# EAGLE design Primate (EAGLE 9.6.2)

## Sheet 1 of 2
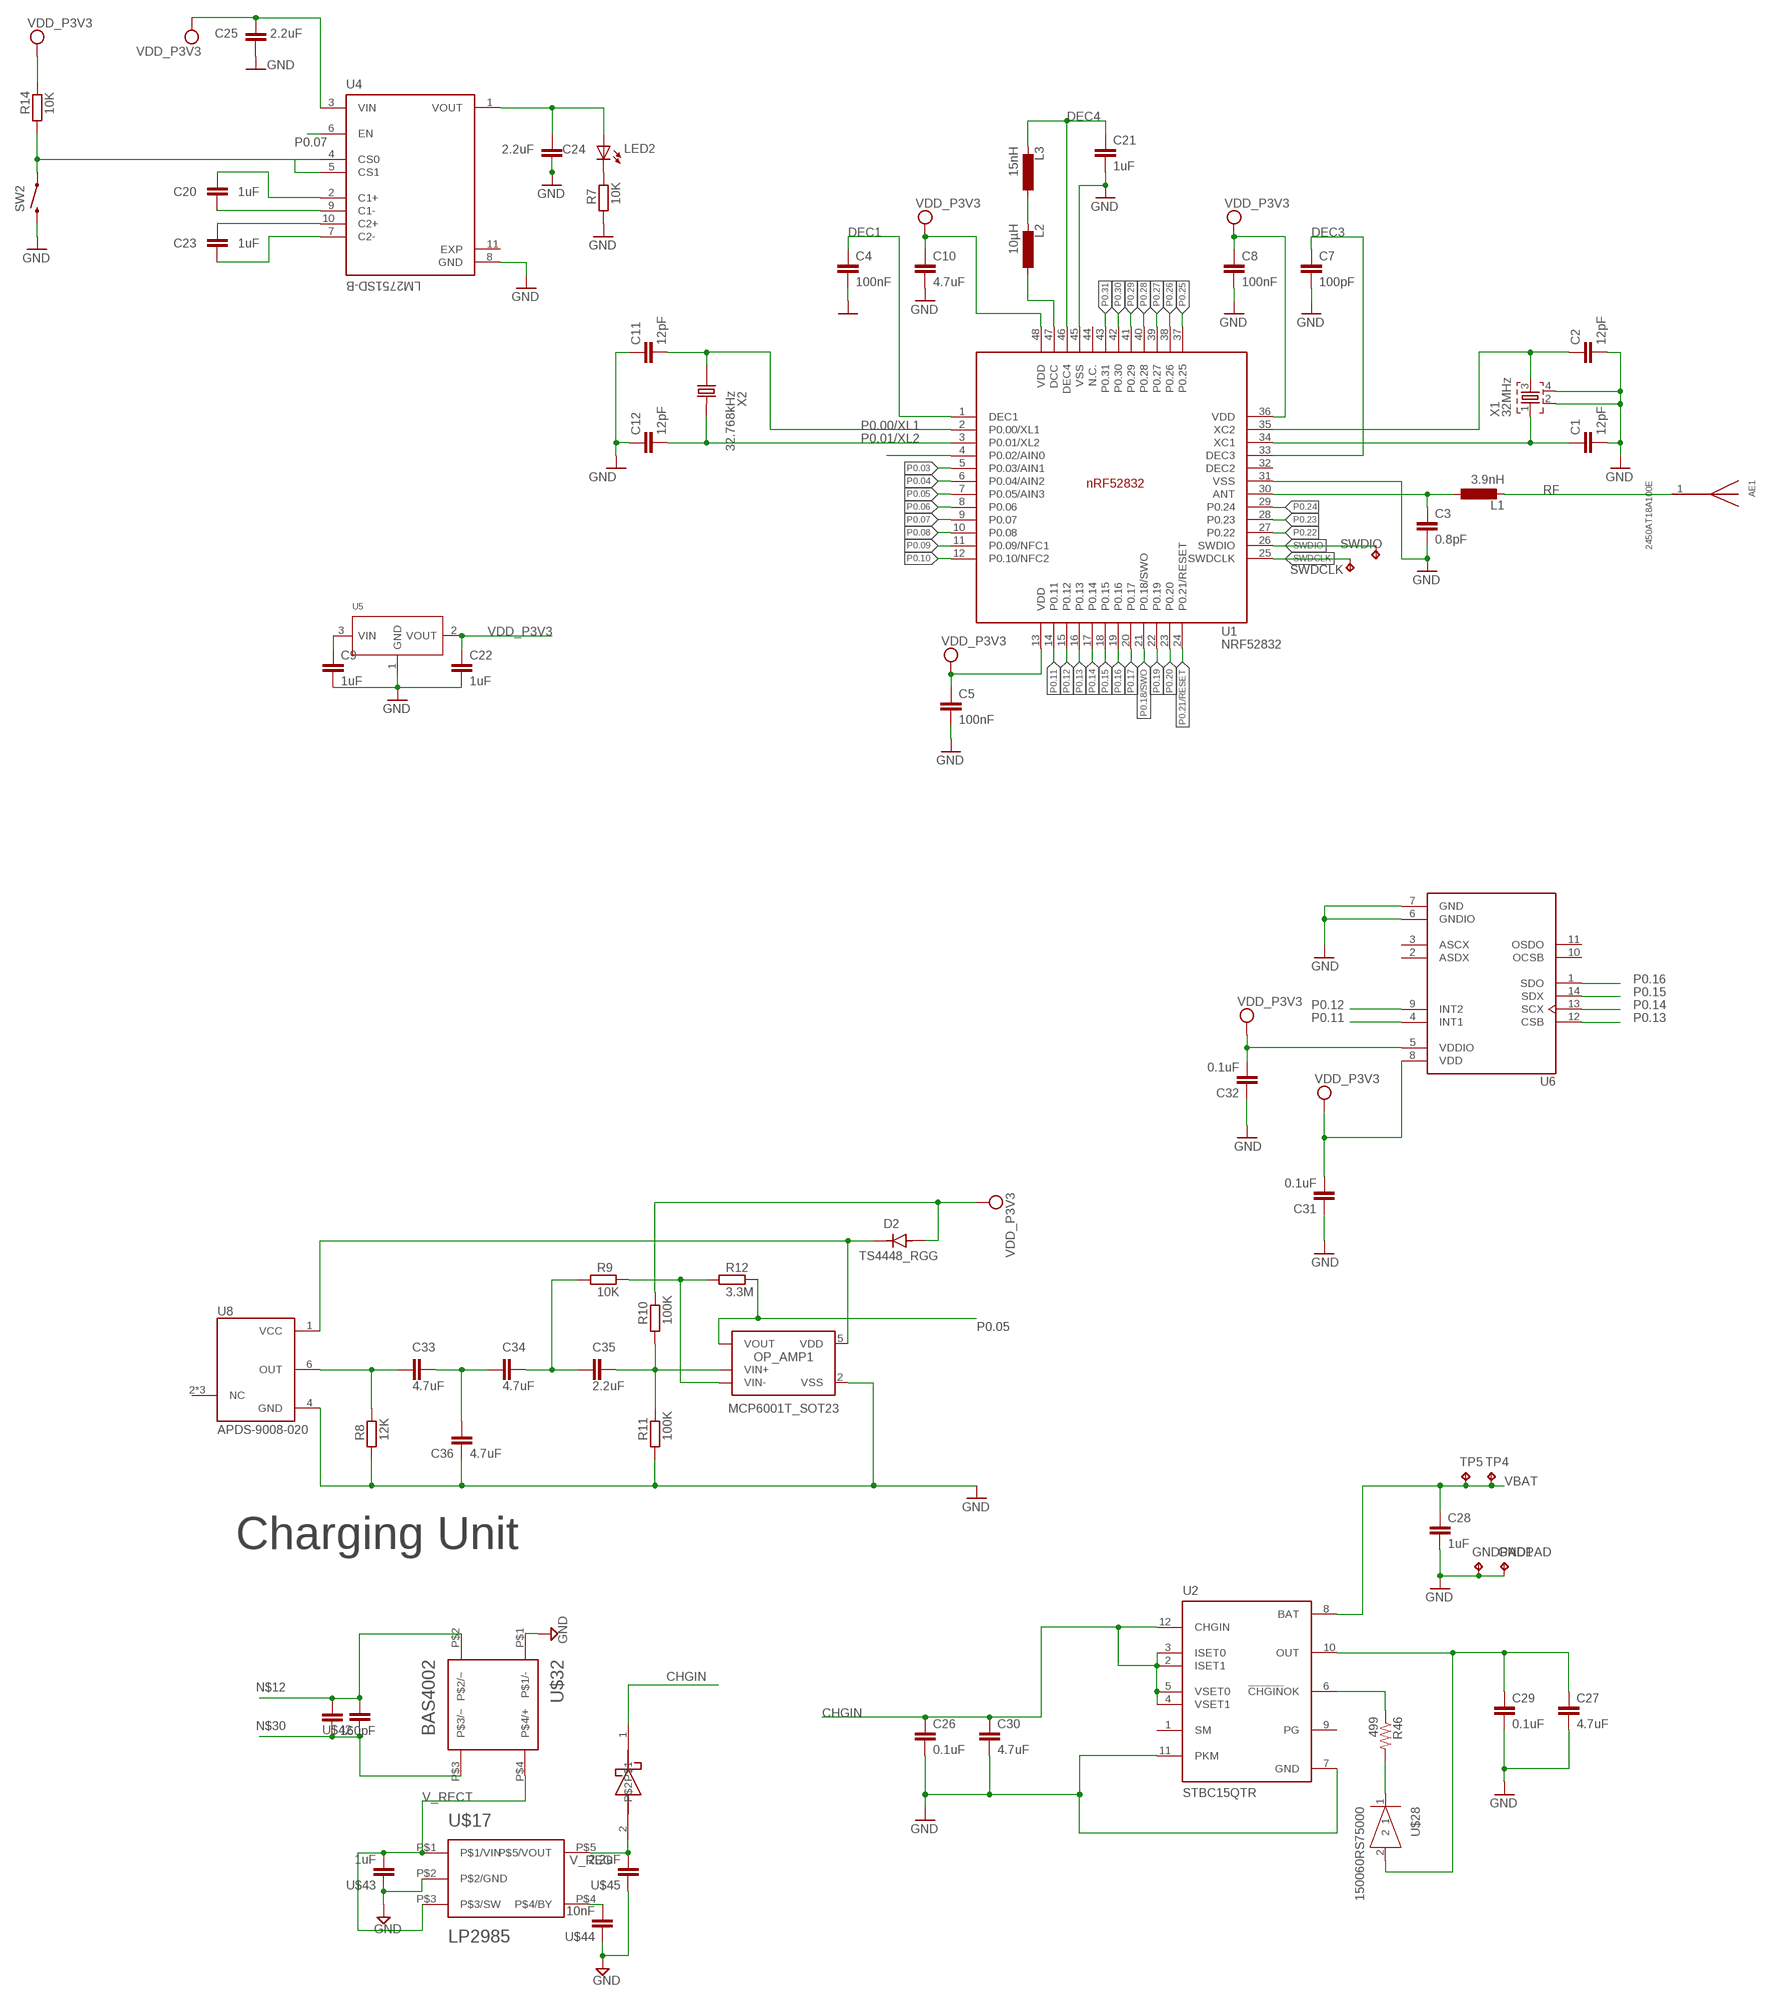
[diagram p0: schematic, sheet 1]

### Parts
AE1  2450AT18A100E  [ANTC3216X140N]
C1  12pF  C-EUC0201  [C0201]
C2  12pF  C-EUC0201  [C0201]
C3  0.8pF  C-EUC0201  [C0201]
C4  100nF  C-EUC0201  [C0201]
C5  100nF  C-EUC0201  [C0201]
C7  100pF  C-EUC0201  [C0201]
C8  100nF  C-EUC0201  [C0201]
C9  1uF  C-EUC0201  [C0201]
C10  4.7uF  C-EUC0402  [C0402]
C11  12pF  C-EUC0201  [C0201]
C12  12pF  C-EUC0201  [C0201]
C20  1uF  C-EUC0201  [C0201]
C21  1uF  C-EUC0201  [C0201]
C22  1uF  C-EUC0201  [C0201]
C23  1uF  C-EUC0201  [C0201]
C24  2.2uF  C-EUC0402  [C0402]
C25  2.2uF  C-EUC0402  [C0402]
C26  0.1uF  C-EUC0201  [C0201]
C27  4.7uF  C-EUC0402  [C0402]
C28  1uF  C-EUC0201  [C0201]
C29  0.1uF  C-EUC0201  [C0201]
C30  4.7uF  C-EUC0402  [C0402]
C31  0.1uF  C-EUC0201  [C0201]
C32  0.1uF  C-EUC0201  [C0201]
C33  4.7uF  C-EUC0402  [C0402]
C34  4.7uF  C-EUC0402  [C0402]
C35  2.2uF  C-EUC0402  [C0402]
C36  4.7uF  C-EUC0402  [C0402]
D2  TS4448_RGG  [DIO_TS4448_RGG]
GNDPAD  TPTP20SQ  [TP20SQ]
GNDPAD1  TPTP20SQ  [TP20SQ]
L1  3.9nH  L-EUL0201  [L0201]
L2  10µH  L-EUL0201  [L0201]
L3  15nH  L-EUL0201  [L0201]
LED2  LEDCHIPLED_0805  [CHIPLED_0805]
OP_AMP1  MCP6001T_SOT23  [SOT95P280X145-5N]
R7  10K  RR0603  [R0603]
R8  12K  RR0603  [R0603]
R9  10K  RR0603  [R0603]
R10  100K  RR0603  [R0603]
R11  100K  RR0603  [R0603]
R12  3.3M  RR0603  [R0603]
R14  10K  RR0603  [R0603]
R46  499  R-US_R0201  [R0201]
SW2  RS032G05A3SM-SPST-MOMENTARY-SWSMD-1101NE  [TACTILE-SWITCH-1101NE]
SWDCLK  TPB1,27  [B1,27]
SWDIO  TPB1,27  [B1,27]
TP4  TPTP20SQ  [TP20SQ]
TP5  TPTP20SQ  [TP20SQ]
U1  NRF52832  [QFN40P600X600X90-48_N]
U2  STBC15QTR  [QFN40P200X170X55-12N]
U4  LM2751SD-B  [SON50P300X300X80-11N]
U5  PMIC-LDO-XC6206P302MR(SOT23)  [SOT-23]
U6  BMI160  [PQFN50P250X300X88-14N]
U8  APDS-9008-020  [XDCR_APDS-9008-020]
U$17  LP2985  [SOT-23]
U$28  150060RS75000  [150060RS75000]
U$32  BAS4002  [SOT143]
U$41  160pF  C-EUC0201  [C0201]
U$42  5pF  C-EUC0201  [C0201]
U$43  1uF  C-EUC0201  [C0201]
U$44  10nF  C-EUC0201  [C0201]
U$45  2.2uF  C-EUC0201  [C0201]
U$46  CDBQC0130L-HF  [0402DIODE]
X1  32MHz  XTAL_32MHZ  [BT-XTAL_2016_N]
X2  32.768kHz  ECS-.327-7-12-TR  [XTAL_ECS-.327-7-12-TR]

### Nets
ANT: C3.1 L1.1 U1.30(ANT)
CHGIN: C26.1 C30.1 U2.2(ISET1) U2.3(ISET0) U2.4(VSET1) U2.5(VSET0) U2.12(CHGIN) U$46.1
DEC1: C4.1 U1.1(DEC1)
DEC3: C7.1 U1.33(DEC3)
DEC4: C21.1 L3.2 U1.46(DEC4)
GND: C1.2 C2.2 C3.2 C4.2 C5.2 C7.2 C8.2 C9.2 C10.2 C11.1 C12.1 C21.2 C22.2 C24.2 C25.2 C26.2 C27.2 C28.2 C29.2 C30.2 C31.1 C32.1 C36.2 GNDPAD1.TP GNDPAD.TP OP_AMP1.2(VSS) R7.1 R8.1 R11.1 SW2.2 U1.31(VSS) U1.45(VSS) U2.7(GND) U2.11(PKM) U4.8(GND) U5.1(GND) U6.6(GNDIO) U6.7(GND) U8.4(GND) U$17.P$2(P$2/GND) U$32.P$1(P$1/-) U$43.1 U$44.1 U$45.1 X1.2 X1.4
N$2: L2.2 L3.1
N$3: C2.1 U1.35(XC2) X1.3
N$4: L2.1 U1.47(DCC)
N$12: U$32.P$2(P$2/~) U$41.1 U$42.2
N$13: R46.2 U$28.1
N$25: C33.2 R8.2 U8.6(OUT)
N$26: C27.1 C29.1 U2.10(OUT) U$28.2
N$28: R46.1 U2.6(!CHGIN!OK)
N$30: U$32.P$3(P$3/~) U$41.2 U$42.1
N$41: U$17.P$4(P$4/BY) U$44.2
N$48: C20.1 U4.2(C1+)
N$49: C20.2 U4.9(C1-)
N$50: C23.1 U4.10(C2+)
N$51: C24.1 LED2.A U4.1(VOUT)
N$52: C23.2 U4.7(C2-)
N$53: C33.1 C34.2 C36.1
N$54: LED2.C R7.2
N$55: C34.1 C35.2 R9.1
N$56: D2.C(K) OP_AMP1.5(VDD) U8.1(VCC)
N$58: C35.1 OP_AMP1.3(VIN+) R10.1 R11.2
N$59: OP_AMP1.4(VIN-) R9.2 R12.1
N$66: U4.4(CS0) U4.5(CS1)
N$68: R14.1 SW2.1
OUT: U1.4(P0.02/AIN0)
P0.00/XL1: C11.2 U1.2(P0.00/XL1) X2.1
P0.01/XL2: C12.2 U1.3(P0.01/XL2) X2.2
P0.03: U1.5(P0.03/AIN1)
P0.04: U1.6(P0.04/AIN2)
P0.05: OP_AMP1.1(VOUT) R12.2 U1.7(P0.05/AIN3)
P0.06: U1.8(P0.06)
P0.07: U1.9(P0.07) U4.6(EN)
P0.08: U1.10(P0.08)
P0.09: U1.11(P0.09/NFC1)
P0.10: U1.12(P0.10/NFC2)
P0.11: U1.14(P0.11) U6.4(INT1)
P0.12: U1.15(P0.12) U6.9(INT2)
P0.13: U1.16(P0.13) U6.12(CSB)
P0.14: U1.17(P0.14) U6.13(SCX)
P0.15: U1.18(P0.15) U6.14(SDX)
P0.16: U1.19(P0.16) U6.1(SDO)
P0.17: U1.20(P0.17)
P0.18/SWO: U1.21(P0.18/SWO)
P0.19: U1.22(P0.19)
P0.20: U1.23(P0.20)
P0.21/RESET: U1.24(P0.21/RESET)
P0.22: U1.27(P0.22)
P0.23: U1.28(P0.23)
P0.24: U1.29(P0.24)
P0.25: U1.37(P0.25)
P0.26: U1.38(P0.26)
P0.27: U1.39(P0.27)
P0.28: U1.40(P0.28)
P0.29: U1.41(P0.29)
P0.30: U1.42(P0.30)
P0.31: U1.43(P0.31)
RF: AE1.1 L1.2
SWDCLK: SWDCLK.TP U1.25(SWDCLK)
SWDIO: SWDIO.TP U1.26(SWDIO)
V_RECT: U$17.P$1(P$1/VIN) U$17.P$3(P$3/SW) U$32.P$4(P$4/+) U$43.2
V_REG: U$17.P$5(P$5/VOUT) U$45.2 U$46.2
VBAT: C28.1 TP4.TP TP5.TP U2.8(BAT)
VBAT1: C9.1 U5.3(VIN)
VDD_P3V3: C5.1 C8.1 C10.1 C22.1 C25.1 C31.2 C32.2 D2.A R10.2 R14.2 U1.13(VDD) U1.36(VDD) U1.48(VDD) U4.3(VIN) U5.2(VOUT) U6.5(VDDIO) U6.8(VDD)
X1: C1.1 U1.34(XC1) X1.1
Unconnected: U1.32(DEC2) U1.44(N.C.) U2.1(SM) U2.9(PG) U6.2(ASDX) U6.3(ASCX) U6.10(OCSB) U6.11(OSDO) U8.2(NC) U8.3(NC) U8.5(NC)

### Notes on the sheet
- Charging Unit

## Sheet 2 of 2
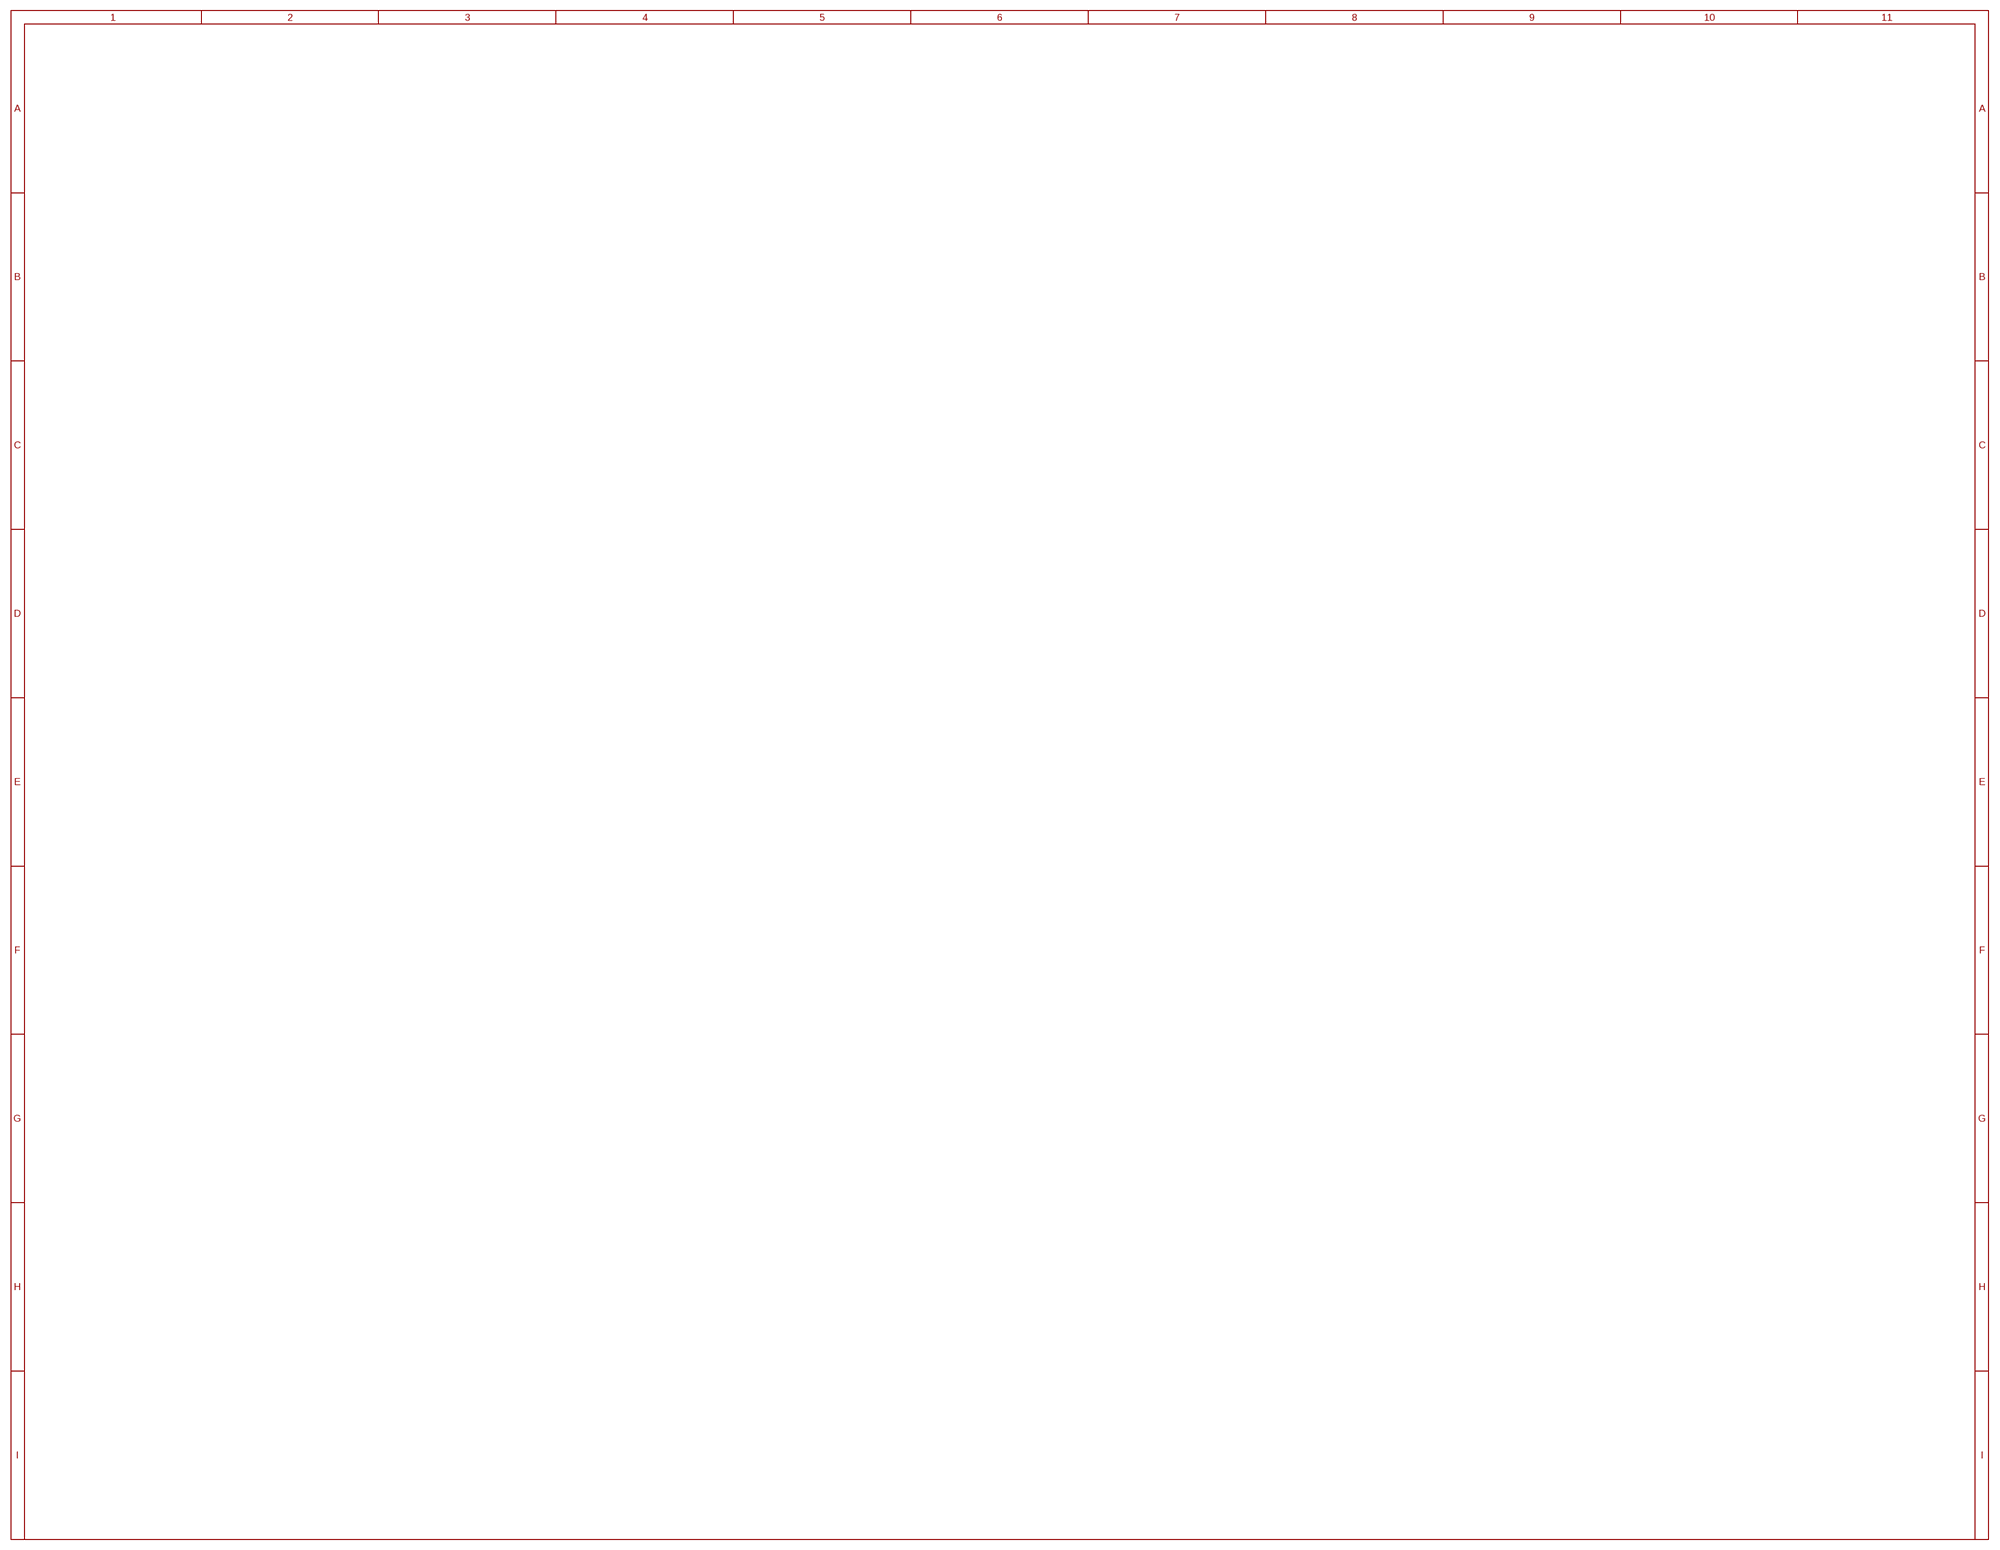
[diagram p1: schematic, sheet 2]

## Power pins joined to a net without a drawn wire
EXP: U4.11(EXP)

## Library data of the parts
AE1 = 2450AT18A100E:2450AT18A100E: ANTENNA, CERAMIC, 2.45GHZ; Bandwidth: 100MHz; Frequency: 2.45GHz; Gain: -0.5dB; Impedance: 50ohm; DESCRIPTION: ANTENNA, CERAMIC, 2.45GHZ; Bandwidth: 100MHz; Frequency: 2.45GHz; Gain: -0.5dB; Impedance: 50ohm; DIGI-KEY_PART_NUMBER: 712-1005-1-ND; DIGI-KEY_PURCHASE_URL: https://www.digikey.com/product-detail/en/johanson-technology-inc/2450AT18A100E/712-1005-1-ND/1560834?utm_source=snapeda&utm_medium=aggregator&utm_campaign=symbol; MF: Johanson Technology; MP: 2450AT18A100E; PACKAGE: FBGA-780 Johanson
C1-C5 C7-C12 C20-C36 U$41-U$45 = rcl:C-EU: CAPACITOR, European symbol; SPICEPREFIX: C
D2 = TS4448_RGG:TS4448_RGG: Check availability; AVAILABILITY: In Stock; DESCRIPTION: 603, 100V, 0.125A, Switching Diode & Array; MF: Taiwan Semiconductor; MP: TS4448 RGG; PACKAGE: 0603 Taiwan Semiconductor; PRICE: None; PURCHASE-URL: https://pricing.snapeda.com/search/part/TS4448 RGG/?ref=eda
GNDPAD GNDPAD1 TP4 TP5 = testpad150:TP: Test pad
L1-L3 = rcl:L-EU: INDUCTOR, European symbol; SPICEPREFIX: L
LED2 = adafruit:LED: LED OSRAM: - CHIPLED LG R971, LG N971, LY N971, LG Q971, LY Q971, LO R971, LY R971 LH N974, LH R974 LS Q976, LO Q976, LY Q976 LO Q996 - Hyper CHIPLED LW Q18S LB Q993, LB Q99A, LB R99A - SideLED LS A670, LO A670, LY A670, LG A670, LP A670 LB A673, LV A673, LT A673, LW A673 LH A674 LY A675 LS A676, LA A676, LO A676, LY A676, LW A676 LS A679, LY A679, LG A679 - Hyper Micro SIDELED® LS Y876, LA Y876, LO Y876, LY Y876 LT Y87S - SmartLED LW L88C, LW L88S LB L89C, LB L89S, LG L890 LS L89K, LO L89K, LY L89K LS L896, LA L896, LO L896, LY L896 - TOPLED LS T670, LO T670, LY T670, LG T670, LP T670 LSG T670, LSP T670, LSY T670, LOP T670, LYG T670 LG T671, LOG T671, LSG T671 LB T673, LV T673, LT T673, LW T673 LH T674 LS T676, LA T676, LO T676, LY T676, LB T676, LH T676, LSB T676, LW T676 LB T67C, LV T67C, LT T67C, LS T67K, LO T67K, LY T67K, LW E67C LS E67B, LA E67B, LO E67B, LY E67B, LB E67C, LV E67C, LT E67C LW T67C LS T679, LY T679, LG T679 LS T770, LO T770, LY T770, LG T770, LP T770 LB T773, LV T773, LT T773, LW T773 LH T774 LS E675, LA E675, LY E675, LS T675 LS T776, LA T776, LO T776, LY T776, LB T776 LHGB T686 LT T68C, LB T68C - Hyper Mini TOPLED® LB M676 - Mini TOPLED Santana® LG M470 LS M47K, LO M47K, LY M47K Source: http://www.osram.convergy.de/
OP_AMP1 = IC_Linear:MCP6001T: Low-Power Operational Amplifier Reference Datasheet; CATEGORY: Amplifier; DESCRIPTION: Low-Power Operational Amplifier; MANUFACTURER: Microchip Technology; MPN: Generic; SERIES: MCP6001; SUB-CATEGORY: OpAmp
R7-R12 R14 = eagle-ltspice:R: RESISTOR, European symbol; SPICEMODEL: NONE; SPICEPREFIX: R
R46 = R_0201_custom:R-US_: RESISTOR, American symbol; SPICEPREFIX: R
SW2 = BeagleBone_Blue_R3:RS032G05A3SM-SPST-MOMENTARY-SW: 6x3.5mm 2-pin Momentary Switch (Push-button) Digikey Link Datasheet; PROD_ID: SWCH-00815
SWDCLK SWDIO = testpad:TP: Test pad
U1 = Nordic_nRF_2:NRF52832: nRF52832 Features Single chip, highly flexible, 2.4 GHz multi-protocol SoC 32-bit ARM Cortex-M4F Processor 1.7v to 3.6v operation 512kB flash + 64kB RAM Supports concurrent Bluetooth Smart/ANT protocol operation On-chip NFC tag for Out-of-Band (OOB) pairing Up to +4dBm output power -96dBm sensitivity, Bluetooth Smart Thread safe and run-time protected Event driven API On air compatible with nRF24L and nRF24AP series 2 data rates (2Mbps/1Mbps) PPI - maximum flexibility for power-efficient applications and code simplification Automated power management system with automatic power management of each peripheral Configurable I/O mapping for analog and digital I/O 3 x Master/Slave SPI 2 x Two-wire interface (I²C) UART (RTS/CTS) 3 x PWM AES HW encryption Real Time Counter (RTC) Digital microphone interface (PDM) On-chip balun Applications Internet of Things (IoT) Wearables SmartHome sensors Connected white goods Computer peripherals Voice-command smart remotes A4WP ‘Rezence’ wireless charging Beacons Sports and fitness sensors and hubs Connected health products Smart watches RC Toys Interactive games Building automation and sensor networks
U2 = STBC15QTR:STBC15QTR: Charger IC Lithium-Ion 12-QFN (1.7x2) Check prices; AVAILABILITY: Warning; DESCRIPTION: Charger IC Lithium Ion 12-QFN (1.7x2); MF: STMicroelectronics; MP: STBC15QTR; PACKAGE: UFQFN-12 STMicroelectronics; PRICE: None; PURCHASE-URL: https://pricing.snapeda.com/search/part/STBC15QTR/?ref=eda
U4 = LM2751SD-B:LM2751SD-B: LED Driver IC 1 Output DC DC Regulator Switched Capacitor (Charge Pump) PWM Dimming 150mA 10-WSON (3x3) Check availability; AVAILABILITY: In Stock; DESCRIPTION: Regulated 2X, 1.5X Switched capacitor White LED driver; MF: Texas Instruments; MP: LM2751SD-B/NOPB; PACKAGE: WSON-10 Texas Instruments; PRICE: None; PURCHASE-URL: https://pricing.snapeda.com/search/part/LM2751SD-B/NOPB/?ref=eda
U5 = PMIC-LDO-XC6206P302MR_SOT23_:PMIC-LDO-XC6206P302MR(SOT23): 310030009; AVAILABILITY: Unavailable; DESCRIPTION: SMD PMIC; LDO; Vin 6V; 3.0V; 200mA; Without En; 1-Ch; MF: Torex; MP: XC6206P302MR; PACKAGE: SOT-23-3 Torex; PRICE: None
U6 = BMI160:BMI160: Accelerometer, Gyroscope, 6 Axis Sensor I²C, SPI Output Check prices; AVAILABILITY: Bad; DESCRIPTION: Accelerometer, Gyroscope, 6 Axis Sensor I²C, SPI Output; MF: Bosch; MP: BMI160; PACKAGE: LGA-14 Bosch; PRICE: None
U8 = APDS-9008-020:APDS-9008-020: Check availability; AVAILABILITY: In Stock; DESCRIPTION: Optical Sensor Ambient 565nm Current 6-SMD, No Lead; MF: Broadcom / Avago; MP: APDS-9008-020; PACKAGE: None; PRICE: None; PURCHASE-URL: https://pricing.snapeda.com/search/part/APDS-9008-020/?ref=eda
U$17 = BLE NICU:LP2985
U$28 = NICU:150060RS75000
U$32 = BLE NICU:BAS4002
U$46 = BLE NICU:CDBQC0130L-HF
X1 = Nordic_nRF:XTAL_32MHZ
X2 = ECS-.327-7-12-TR:ECS-.327-7-12-TR: SMD Tuning Fork Crystal; AVAILABILITY: Unavailable; DESCRIPTION: 32.768kHz ±20ppm Crystal 7pF 90 kOhms 2-SMD, No Lead; MF: ECS Inc.; MP: ECS-.327-7-12-TR; PACKAGE: SMD-2 ECS International; PRICE: None

## Board
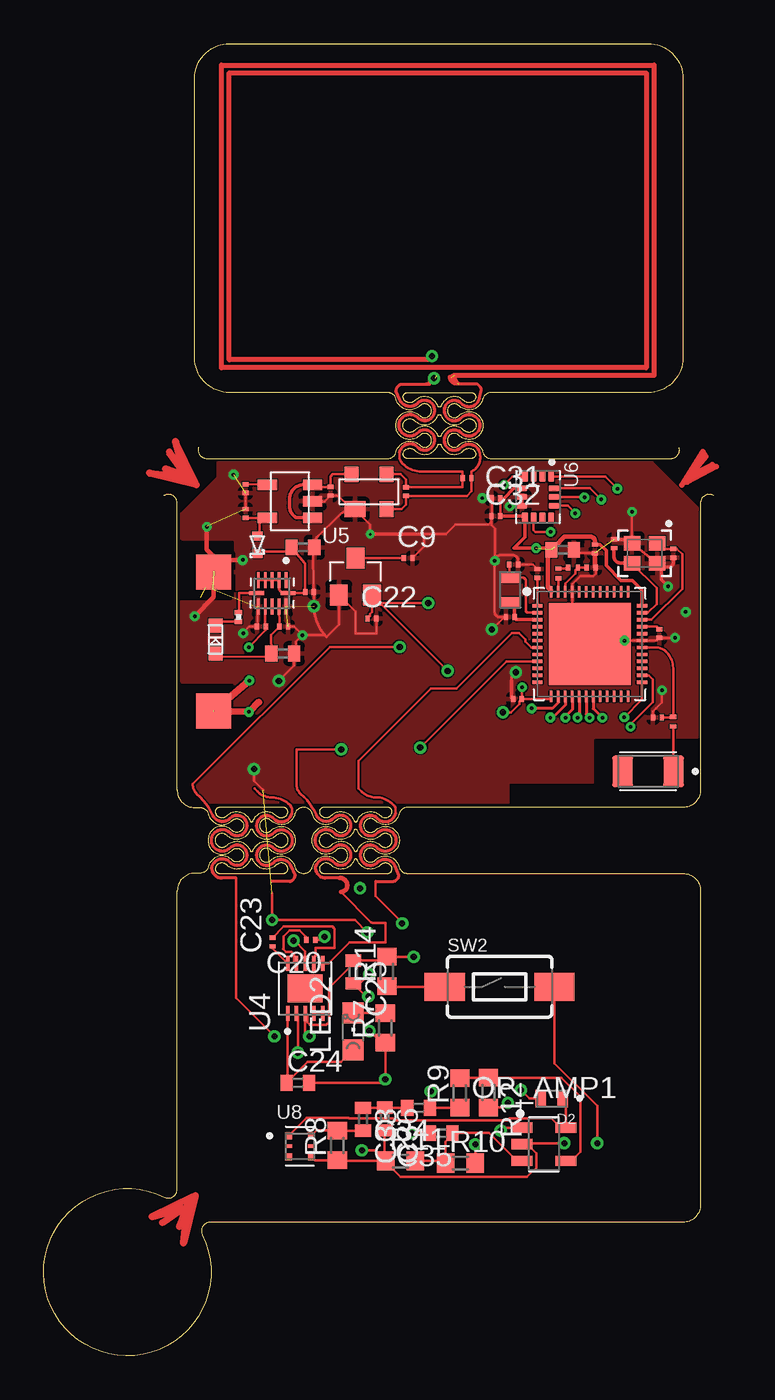
[diagram p2: board, top side]
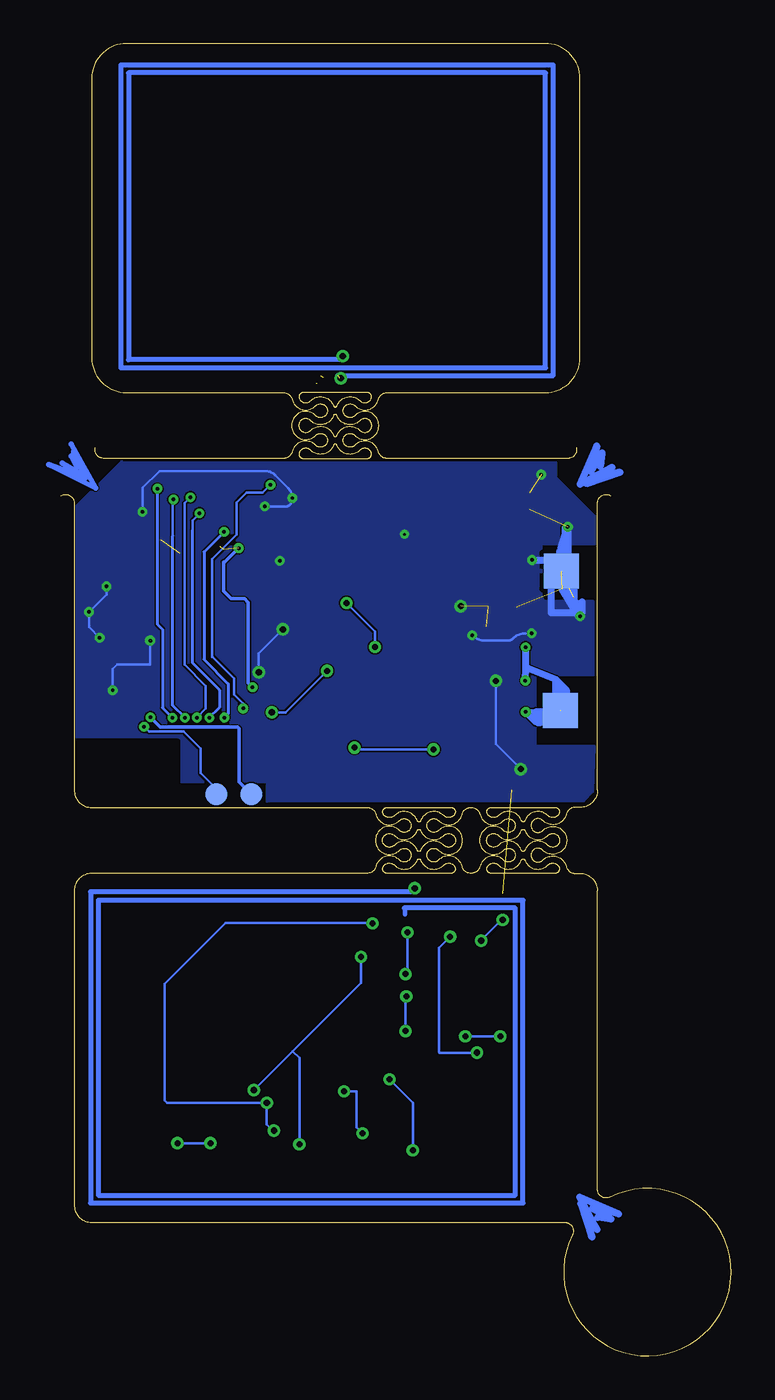
[diagram p3: board, bottom side, seen from below]

Size 38.43 x 75.21 mm. Coordinates in mm from the lower left corner, seen from the top.
Outline: 148 segments
Copper layers (1*16): Top 0.018mm / dielectric 0.064mm / Bottom 0.018mm
Design rules "Nordic *": minimum track width 3mil, minimum drill 0.15mm, track to track 3mil, track to pad 6mil, pad to pad 3mil, via to via 3mil, smd to smd 10mil, copper to edge 3mil, drill to drill 6mil, minimum pad ring 10mil, minimum via ring 7mil, stop-mask expansion 4mil, vias tented up to drill 0mil, thermal gap 10mil
tRestrict: area 31.7,31.5 to 37.6,35.2
bRestrict: area 31.7,31.5 to 37.6,35.2

### Footprints (pad centres in the part's own frame; a part is rotated, then mirrored left to right if it is on the bottom)
ANTC3216X140N = smd 1.2 x 1.82: 1 -1.46,0; 2 1.46,0
C0201 = smd 0.25 x 0.35: 1 -0.25,0; 2 0.25,0
C0402 = smd 0.7 x 0.9: 1 -0.65,0; 2 0.65,0
DIO_TS4448_RGG = smd 0.6 x 1: A 0.625,0; C -0.625,0
TP20SQ = smd 2 x 2: TP 0,0
L0201 = smd 0.25 x 0.35: 1 -0.275,0; 2 0.275,0
CHIPLED_0805 = smd 1.2 x 1.2: A 0,-1.05; C 0,1.05
SOT95P280X145-5N = smd 1.186 x 0.597: 1 -1.264,0.95; 2 -1.264,0; 3 -1.264,-0.95; 4 1.264,-0.95; 5 1.264,0.95
R0603 = smd 1 x 1.1: 1 -0.85,0; 2 0.85,0
R0201 = smd 0.28 x 0.43: 1 -0.255,0; 2 0.255,0
TACTILE-SWITCH-1101NE = smd 2.3 x 1.6: 1 -3.15,0; 2 3.15,0
B1,27 = smd 1.27 x 1.27: TP 0,0
QFN40P600X600X90-48_N = smd 0.65 x 0.2: 1 -3,2.2; 2 -3,1.8; 3 -3,1.4; 4 -3,1; 5 -3,0.6; 6 -3,0.2; 7 -3,-0.2; 8 -3,-0.6; 9 -3,-1; 10 -3,-1.4; 11 -3,-1.8; 12 -3,-2.2; 25 3,-2.2; 26 3,-1.8; 27 3,-1.4; 28 3,-1; 29 3,-0.6; 30 3,-0.2; 31 3,0.2; 32 3,0.6; 33 3,1; 34 3,1.4; 35 3,1.8; 36 3,2.2 | smd 0.2 x 0.65: 13 -2.2,-3; 14 -1.8,-3; 15 -1.4,-3; 16 -1,-3; 17 -0.6,-3; 18 -0.2,-3; 19 0.2,-3; 20 0.6,-3; 21 1,-3; 22 1.4,-3; 23 1.8,-3; 24 2.2,-3; 37 2.2,3; 38 1.8,3; 39 1.4,3; 40 1,3; 41 0.6,3; 42 0.2,3; 43 -0.2,3; 44 -0.6,3; 45 -1,3; 46 -1.4,3; 47 -1.8,3; 48 -2.2,3 | smd 4.7 x 4.7: PAD 0,0
QFN40P200X170X55-12N = smd 0.91 x 0.22: 1 -0.76,0.8; 2 -0.76,0.4; 3 -0.76,0; 4 -0.76,-0.4; 5 -0.76,-0.8; 7 0.76,-0.8; 8 0.76,-0.4; 9 0.76,0; 10 0.76,0.4; 11 0.76,0.8 | smd 0.22 x 0.91: 6 0,-0.91; 12 0,0.91
SON50P300X300X80-11N = smd 0.86 x 0.27: 1 -1.435,1; 2 -1.435,0.5; 3 -1.435,0; 4 -1.435,-0.5; 5 -1.435,-1; 6 1.435,-1; 7 1.435,-0.5; 8 1.435,0; 9 1.435,0.5; 10 1.435,1 | smd 1.6 x 2: 11 0,0
SOT-23 = smd 1.016 x 1.2: 1 -0.95,-1.06; 2 0.95,-1.06; 3 0,1.06
PQFN50P250X300X88-14N = smd 0.59 x 0.35: 1 -1.165,0.75; 2 -1.165,0.25; 3 -1.165,-0.25; 4 -1.165,-0.75; 8 1.165,-0.75; 9 1.165,-0.25; 10 1.165,0.25; 11 1.165,0.75 | smd 0.35 x 0.59: 5 -0.5,-0.915; 6 0,-0.915; 7 0.5,-0.915; 12 0.5,0.915; 13 0,0.915; 14 -0.5,0.915
XDCR_APDS-9008-020 = smd 0.4 x 0.4: 1 -0.65,0.6; 3 -0.65,-0.6; 4 0.65,-0.6; 6 0.65,0.6 | smd 0.4 x 0.2: 2 -0.65,0; 5 0.65,0
SOT-23' = smd 0.6 x 1.1: P$1 0,0; P$2 0.95,0; P$3 1.9,0; P$4 1.9,2.6; P$5 0,2.6
150060RS75000 = smd 0.8 x 0.8: 1 -0.8,0; 2 0.8,0
SOT143 = smd 1.2 x 0.9: P$1 0,0 | smd 0.8 x 0.9: P$2 1.8,0; P$3 1.8,2; P$4 -0.2,2
0402DIODE = smd 0.5 x 0.6: 1 -0.5,0; 2 0.5,0
BT-XTAL_2016_N = smd 0.95 x 0.85: 1 -0.725,-0.575; 2 0.725,-0.575; 3 0.725,0.575; 4 -0.725,0.575
XTAL_ECS-.327-7-12-TR = smd 0.6 x 1.1: 1 -0.7,0; 2 0.7,0

### Placement (x,y rotation side)
AE1  34.65,33.5 180 top
C1  36.1,46 270 top
C2  32.7,46.55 90 top
C3  35.19,36.6 180 top
C4  28.3,44.85 90 top
C5  27.16,37.64 180 top
C7  35.3,41.4 270 top
C8  31.6,46.25 270 top
C9  20.9,45.72 0 top
C10  29.75,46.2 0 top
C11  26.95,45.36 180 top
C12  26.75,42.35 0 top
C20  15.32,23.84 180 top
C21  31.39,45.17 0 top
C22  18.82,42.25 0 top
C23  13.13,23.72 90 top
C24  14.57,15.64 0 top
C25  17.75,22 270 top
C26  15.24,43.79 0 top
C27  13.71,40.25 0 top
C28  12.48,41.81 180 top
C29  13.76,41.79 0 top
C30  14.87,46.34 0 top
C31  25.93,49.15 0 top
C32  25.92,48.14 0 top
C33  18.32,13.56 270 top
C34  21.5,14.21 180 top
C35  22.79,12.77 180 top
C36  19.56,13.58 270 top
D2  29.13,14.75 180 top
GNDPAD  9.74,44.98 180 bottom
GNDPAD1  9.75,44.93 0 top
L1  36.09,36.35 270 top
L2  29.5,44.85 90 top
L3  30.35,45.19 0 top
LED2  17.75,18.6 0 top
OP_AMP1  28.68,12.13 0 top
R7  19.59,18.81 90 top
R8  16.84,12.06 90 top
R9  23.86,15.07 90 top
R10  23.89,11.05 0 top
R11  20.46,11.18 0 top
R12  25.5,15.09 270 top
R14  19.68,22.03 90 top
R46  11.17,42.34 270 top
SW2  26.14,21.16 0 top
SWDCLK  27.5,32.2 180 bottom
SWDIO  29.5,32.2 180 bottom
TP4  9.78,36.99 180 bottom
TP5  9.75,36.96 0 top
U1  31.3,40.8 0 top
U2  13.11,43.71 270 top
U4  14.99,21.06 90 top
U5  17.88,44.67 0 top
U6  28.34,49.23 270 top
U8  14.7,12.02 0 top
U$17  LP2985  [SOT-23']  15.42,48.03 90 top
U$28  9.85,41.06 270 top
U$32  17.85,48.53 0 top
U$41  24.28,50.31 180 top
U$42  20.77,49.54 270 top
U$43  16.44,49.56 90 top
U$44  11.57,49.71 90 top
U$45  11.57,48.28 270 top
U$46  12.25,46.48 90 top
X1  34.45,46 180 top
X2  26.75,43.9 270 top

### Tracks (layer width: path | path; a pad name or v marks a point on that pad's centre or on a via)
ANT
  Top 0.135: U1.30 35.1,40.6 arc-45 35.7,40.35 arc-45 36.09,39.42 L1.1
  Top 0.152: C3.1 36.06,36.6 L1.1
CHGIN
  Top 0.152: U$46.1 12.36,46.09 14.23,46.09 14.22,46.1 C30.1 15,45.42 C26.1 14.92,43.71 U2.12 13.93,43.71 arc-45 13.53,43.88 arc-45 13.51,43.94 U2.2 | U2.5 U2.4 U2.2 | U2.3 U2.2
DEC1
  Top 0.152: C4.1 U1.1
DEC3
  Top 0.152: 34.63,41.8 U1.33 35.15,41.8 C7.1
DEC4
  Top 0.152: U1.46 29.9,44.25 30.48,44.83 30.48,45.04 L3.2 30.64,45.17 C21.1
GND  (via drill 0.15, 0.2, 0.35)  (12 unrouted)
  Top 0.15: X1.2 X1.4 | C8.2 30.6,46 C10.2 | C7.2 v36.2,41.15 | v35.45,38.15 35.45,37.45 35.1,37.1 35.1,37.09 34.94,36.93 C3.2
  Top 0.152: C21.2 31.65,45.16 31.65,44.83 31.52,44.7 30.77,44.7 30.33,44.25 30.33,43.82 U1.45 30.3,42.73 30.31,42.72 | C7.2 35.15,41 U1.31 | U$17.P$2 15.44,48.97 16.1,48.97 U$43.1 16.87,49.31 17.64,48.53 U$32.P$1 | U$44.1 11.57,49.42 U$45.1 | v14.84,41.3 14.84,41.33 14.37,41.81 14.03,41.81 C29.2 | v14.84,41.3 14.47,40.93 14.46,40.35 C27.2 14.36,39.57 v13.48,38.69 | 16.12,41.3 v14.84,41.3 | 12.28,42.92 12.28,41.9 12.23,41.86 C28.2 11.78,41.8 11.44,41.46 v11.44,41.41 | v15.5,42.97 15.49,42.96 | 15.49,42.96 C26.2 15.46,43.82 15.45,46.27 | 15.45,46.27 C30.2 | C4.2 28.04,45.36 C11.1 27.2,45.59 arc90 26.89,45.9 26.19,45.9 arc90 26.19,45.89 arc90 v25.87,45.57 | 25.67,47.82 C32.1 25.69,48.16 25.69,49.2 25.68,49.2 C31.1 25.17,49.15 arc-90 v25.15,49.16 | 25.67,47.82 25.5,47.65 23.61,47.65 23.06,47.09 21.8,47.09 21.8,46.37 C9.2 | 27.4,49.2 U6.6 U6.7 arc-90 27.38,48.68 v26.73,48.68 | U$32.P$1 18.72,47.66 v18.72,47.09 | U$32.P$1 arc45 16.91,48.14 15.74,46.98 arc45 15.45,46.27 | U1.31 33.88,41 | U1.31 v33.3,41 | X1.2 33.73,48.39 v33.74,48.38 | v25.87,45.57 v25.86,45.57 25.86,42.62 arc90 26.13,42.35 C12.1 26.41,42.35 v25.7,41.64 | 15.49,42.96 arc45 16.22,41.21 16.93,41.92 U5.1 17.89,42.65 17.89,41.39 19.08,41.39 19.08,42.24 C22.2 | U8.4 15.55,11.21 R8.1 16.87,11.18 R11.1 | R11.1 19.61,11.13 20.47,10.27 27.72,10.27 28.24,10.79 28.24,11.6 27.71,12.13 OP_AMP1.2 27.47,12.19 v29.85,12.19 | C36.2 19.56,11.23 | 19.56,11.23 R11.1 | SW2.2 29.29,16.78 31.74,14.33 v31.74,12.19 | v18.62,20.6 18.5,20.6 C25.2 18.13,21.35 v18.67,21.89 | v18.67,18.62 19.33,17.96 R7.1 v19.59,15.85 v19.58,15.85 19.38,15.64 C24.2
  Top 0.152: U4.8 14.99,23.19 14.39,23.8 v14.33,23.8 | v18.55,24.27 17.85,24.98 v13.09,24.98 13.09,26.51 | v18.24,11.78 19.01,11.78 19.56,11.23 | 26.81,38.71 26.81,38.92 v27.08,39.18 | 25.67,47.82 25.67,47.6 25.87,47.41 v25.87,45.57 | v12.06,33.63 12.06,32.96 12.57,32.44
  Top 0.2: C5.2 26.81,37.74 26.81,38.71
  Top 0.203: C2.2 33.5,46.8 arc-90 X1.2 | C1.2 36.1,45.5 arc-90 35.8,45.2 35.4,45.2 | 35.4,45.2 arc-90 X1.4 35.4,45.2 | 35.4,45.2 35.4,44.5 v35.8,44.1 | v18.72,47.09 21.8,47.09
  Top 0.254: C8.2 31.6,45.21 C21.2 | v11.41,45.61 10.1,45.61 10.03,45.54 9.36,46.21 v9.36,47.51 | v8.66,42.39 9.75,43.48 GNDPAD1.TP
  Bottom 0.127: 9.01,43.34 8.54,43.23
  Bottom 0.152: v35.8,44.1 35.8,43.64 v36.81,42.63 36.81,41.76 v36.2,41.15 | v35.45,38.15 35.45,39.37 35.21,39.61 33.32,39.61 33.3,39.63 v33.3,41 | v33.74,48.38 33.74,49.75 32.77,50.72 26.76,50.72 arc45 26.1,50.45 25.39,49.74 arc45 v25.15,49.16 25.15,49.07 arc90 25.54,48.68 | 26.71,48.66 arc90 v26.73,48.68 25.54,48.68 | 25.54,48.68 arc-45 25.53,48.69 | v11.44,41.41 11.78,41.41 arc-45 12.51,41.11 arc45 12.8,40.99 14.1,40.99 arc45 v14.84,41.3 | v31.74,12.19 v29.85,12.19 | v18.62,20.6 18.67,20.55 v18.67,18.62 | v13.09,24.98 13.16,24.98 14.33,23.82 v14.33,23.8 | v18.55,24.27 18.55,22 v18.67,21.89 | v19.58,15.85 18.24,14.51 v18.24,11.78 | v27.08,39.18 27.08,40.26 v25.7,41.64 | v13.48,38.69 13.48,35.06 v12.06,33.63
  Bottom 0.406: 9.36,47.54 9.36,47.53 | 9.36,47.53 v9.36,47.51 | v9.36,47.51 9.36,45.91 | 9.75,46.23 9.36,47.53 | 9.28,44.01 8.68,42.4 8.72,42.36 9.69,43.95 | v9.36,47.51 9.36,46.53 | 9.01,43.45 9.01,43.34 | v11.41,45.61 10.33,45.61 10.33,42.59 8.54,42.59 8.54,43.23
  other vias: 10.89,50.51
  pour Bottom: 10.05,51.2 10.05,50.37 7.82,48.14 7.82,46.52 10.92,46.52 10.89,46.49 10.89,43.45 10.69,43.26 7.91,43.26 7.88,43.23 7.88,39.01 11.22,39.01 11.22,34.95 7.84,34.95 7.91,32.34 8.44,31.81 26.54,31.81 26.61,31.74 26.61,32.88 31.51,32.88 31.51,35.31 31.67,35.48 37.49,35.48 37.54,35.43 37.54,48.69 34.94,51.29 34.85,51.2
  pour Top: 9.98,51.19 9.98,50.37 7.9,48.28 7.9,46.85 7.98,46.77 10.91,46.77 10.98,46.7 10.98,43.45 10.75,43.22 7.88,43.22 7.88,38.67 7.95,38.6 10.96,38.6 10.96,35.31 11,35.27 7.91,35.27 7.8,35.17 7.8,32.45 8.52,31.73 26.63,31.73 26.65,31.71 26.65,32.86 31.49,32.86 31.49,35.35 31.59,35.45 37.48,35.45 37.48,48.43 37.58,48.53 34.88,51.23 10.02,51.23
GND1
  Top 0.152: 14.24,31.09 14.24,31.3 arc45 14.12,31.58 arc45 13.08,32.01 arc-45 12.27,32.34 12.1,32.51
  Top 0.17: 14.24,31.09 arc-121 13.19,30.8 arc270 13.19,29.98 arc-270 13.19,29.1 arc270 13.19,28.28 arc-111 14.17,28.1 14.4,27.54 arc-45 14.31,27.3 14.25,27.24 arc-45 14.11,27.19 13.09,27.19
N$2
  Top 0.152: L2.2 30.01,45.12 L3.1
N$3
  Top 0.152: X1.3 35.15,44 35.15,43.1 34.65,42.6 U1.35
  Top 0.203: C2.1 32.7,45.8 arc90 33.05,45.45 33.7,45.45 arc-90 X1.3
N$4
  Top 0.152: U1.47 L2.1
N$5  (via drill 0.35)
  other vias: 18.14,26.8
N$12
  Top 0.152: 24.96,51.89 arc-87 24.53,50.68 U$41.1 24.53,49.56 24.26,49.29 U$42.2 | U$42.2 20.82,49.29 | U$42.2 20.77,48.78 20.52,48.52 U$32.P$2
  Top 0.17: 24.96,51.89 arc111 23.94,52.07 arc-270 23.94,52.89 arc270 23.94,53.77 arc-270 23.94,54.59 arc121 24.99,54.88 25.09,55.39 arc45 25.02,55.55 24.86,55.71 23.8,55.71 23.41,56.1
  Top 0.2: 23.8,55.71 23.67,55.71 | 23.27,56.11 arc90 23.67,55.71 | 23.37,56.07 arc-90 23.67,55.77 23.67,55.71
N$13
  Top 0.152: U$28.1 10.07,42.08 R46.2
N$18
  Bottom 0.406: 8.62,8.73 7.98,6.8 8.31,8.24 7.69,7.24 8.67,9.09 6.45,8.13 7.94,8.46 6.87,7.83 7.64,7.93
N$19
  Bottom 0.254: 18.76,25.67 18.71,25.67 18.71,25.31
N$21
  Top 0.254: 18.01,27 18.16,26.74 18.28,27
N$23  (via drill 0.35)
  other vias: 22.38,56.03
N$25
  Top 0.152: U8.6 15.64,12.91 R8.2 C33.2
N$26
  Top 0.152: U2.10 C29.1 13.05,41.33 C27.1 12.87,40.06 10.05,40.07 U$28.2
N$27
  Top 0.17: 22.05,55.71 22.52,55.82
N$28
  Top 0.152: R46.1 11.21,42.59 11.21,43.72 U2.6
N$29
  Bottom 0.2: 18.08,26.61 18.14,26.83
N$30  (via drill 0.35)  (5 unrouted)
  Top 0.152: 20.39,51.79 20.39,51.58 arc45 20.58,51.14 arc45 21.69,50.68 24.02,50.68 24.02,50.37 U$41.2 24.02,49.8 24.01,49.79 U$42.1 20.77,50.23 20.47,50.53 U$32.P$3 19.89,50.53
  Top 0.17: 20.39,51.79 arc-121 21.44,52.08 arc270 21.44,52.9 arc-270 21.44,53.78 arc270 21.44,54.59 arc-111 20.43,54.78 20.21,55.31 arc-45 20.33,55.58 20.38,55.63 arc-45 20.52,55.69 21.92,55.69 arc45 22.18,55.8 22.46,56.08 | 22.46,56.03 22.51,55.82 | 23.81,55.71 23.42,56.1 | 23.61,55.85 23.74,55.72
  Top 0.2: 22.11,55.69 21.92,55.69 | 23.28,56.11 arc90 23.68,55.71 23.68,55.77 arc90 23.38,56.07 | v22.26,57.3 22.27,57.08
  Top 0.3: 22.27,57.08 10.64,57.08 10.64,73.53 34.54,73.53 34.54,56.63 10.19,56.63 10.19,73.98 34.99,73.98 34.99,56.18 23.54,56.18
  Bottom 0.2: v22.26,57.3 22.27,57.08
  Bottom 0.3: 22.54,56.18 10.19,56.18 10.19,73.98 34.99,73.98 34.99,56.63 10.64,56.63 10.64,73.53 34.54,73.53 34.54,57.08 22.27,57.08
N$31
  Top 0.15: 22.4,55.79 22.4,55.83 arc90 22.23,56
N$32
  Top 0.15: 23.57,55.81 arc-90 23.45,55.93
N$33
  Top 0.305: 38.32,51.09 37.36,50.6 arc41 37.17,50.39
N$34
  Top 0.17: 22.47,56.08 22.2,55.8 arc-45 21.93,55.69 21.92,55.68
  Top 0.2: 22.12,55.69 22.07,55.69 | 22.07,55.69 21.93,55.69 | 22.07,55.69 22.29,56.12
N$35
  Top 0.305: 38.55,50.97 36.91,50.09 36.75,50.09 37.96,51.55 37.8,51.81 36.6,49.9
N$36
  Bottom 0.406: 9.73,38.3 9.73,37.18 9.82,37.18
N$37
  Top 0.406: 8.7,9.18 8.01,6.48 8.27,8.79 7.79,7.41 8.6,9.13 6.2,7.97 7.98,8.44 6.81,7.63
N$38
  Bottom 0.406: 11.12,36.3 10.89,36.3 10.89,36.81 9.84,36.81
N$39
  Bottom 0.305: 37.82,52.26 36.43,49.74 39.11,51.07 37.03,50.32 38.34,51.18 37.02,50.41 37.7,51.83 37.5,50.93 37.82,51.57
N$41
  Top 0.152: U$44.2 12.81,49.95 U$17.P$4
N$42
  Top 0.152: 22.39,56.21 22.56,56.02 22.47,55.92 22.33,56.21 22.38,55.96
N$43
  Top 0.152: 23.52,56.27 23.26,56.14
N$44
  Bottom 0.406: 11.71,36.86 10.36,36.86 10.36,36.9
N$45
  Bottom 0.406: 9.52,47.46 9.52,46.12 9.84,46.12 9.84,44.44 9.02,44.44 9.02,43.07
N$46
  Bottom 0.406: 8.31,50 6.37,50.64 7.82,50.31 6.82,50.93 8.66,49.95 7.71,52.17 8.04,50.68 7.41,51.75 7.5,50.98
N$47
  Top 0.406: 8.75,49.92 6.05,50.61 8.37,50.35 6.99,50.83 8.71,50.02 7.55,52.42 8.01,50.64 7.2,51.81
N$48  (via drill 0.35)
  Top 0.152: 15.63,23.84 C20.1 15.93,23.84 v16.11,24.02 | 14.49,19.26 U4.2 14.58,19.55 v14.58,17.38
  Bottom 0.152: v16.11,24.02 16.76,23.37 16.76,17.41 16.72,17.38 v14.58,17.38
N$49
  Top 0.152: C20.2 15.07,23.99 14.68,24.38 14.09,24.38 13.75,24.04 13.75,23.32 13.74,23.31 13.89,23.16 14.2,23.16 14.36,23 14.36,22.63 U4.9
N$50
  Top 0.152: U4.10 13.13,23.37 C23.1
N$51
  Top 0.152: LED2.A 17.06,16.86 15.14,16.86 C24.1 13.99,15.72 U4.1
N$52
  Top 0.152: U4.7 15.49,22.83 15.58,22.91 15.58,23.39 16.68,23.39 16.69,23.41 16.69,24.48 16.56,24.61 13.77,24.61 C23.2
N$53
  Top 0.152: C33.1 18.33,14.23 C36.1 19.57,14.21 C34.2
N$54
  Top 0.152: LED2.C R7.2
N$55  (via drill 0.35)
  Top 0.152: R9.1 C34.1 22.15,15.12 v22.19,15.16 | C35.2 21.16,12.77 21.15,12.76 v21.13,12.76
  Bottom 0.152: v21.13,12.76 21.47,13.1 21.47,15.16 v22.19,15.16
N$56
  Top 0.152: U8.1 15.07,13.64 17.48,13.64 17.5,13.62 20.04,13.62 20.17,13.5 26.58,13.5 26.69,13.61 29.12,13.61 29.65,13.08 OP_AMP1.5 29.94,14.56 D2.C
N$57
  Top 0.15: 22.39,55.79 22.39,55.83 arc90 22.22,56
N$58
  Top 0.152: R11.2 22.91,11.18 R10.1 23.04,12.27 23.44,12.67 C35.1 25.53,12.77 27.12,11.18 OP_AMP1.3
N$59
  Top 0.152: R9.2 25.49,15.92 R12.1 29.69,15.94 30.77,14.86 30.77,11.71 30.24,11.18 OP_AMP1.4
N$60
  Top 0.15: 23.56,55.81 arc-90 23.44,55.93
N$65
  Top 0.15: 18.21,27.09 18.21,27.05
N$66
  Top 0.152: U4.4 U4.5
N$68
  Top 0.152: SW2.1 19.71,21.16 R14.1
N$71
  Bottom 0.3: 18.06,26.59 36.72,26.59 36.72,8.76 11.92,8.76 11.92,26.11 36.27,26.11 36.27,9.21 12.37,9.21 12.37,25.66 18.75,25.66
OUT
  Top 0.152: U1.4 28.29,41.79
P0.00/XL1
  Top 0.152: X2.1 26.82,44.67 | C11.2 26.7,44.65 arc-90 X2.1 | X2.1 27.45,44.6 arc-90 27.65,44.4 27.65,42.7 arc90 27.75,42.6 U1.2
P0.01/XL2
  Top 0.152: 26.55,43 arc-90 X2.2
  Top 0.2: X2.2 arc-90 27,42.95 C12.2 arc90 27.15,42.2 U1.3
P0.05  (via drill 0.35)
  Top 0.152: U1.7 27.97,40.6 27.63,40.94 27.63,41.04 27.25,41.42 26.83,41.42 23.68,38.26 22.21,38.26 18.05,34.1 18.05,32.52 18.22,32.35 arc45 19.03,32.01 arc-45 20.07,31.58 arc-45 20.18,31.3 20.18,31.09 | R12.2 26.35,14.24 v26.62,14.5 | v26.21,12.91 26.38,13.08 OP_AMP1.1 | v20.55,24.78 20.55,24.85 19.04,26.36 19.04,27.19
  Top 0.17: 20.18,31.09 arc-121 19.14,30.8 arc270 19.14,29.99 arc-270 19.14,29.1 arc270 19.14,28.29 arc-111 20.12,28.11 20.35,27.54 arc-45 20.25,27.31 20.2,27.25 arc-45 20.06,27.19 19.04,27.19
  Bottom 0.152: v26.21,12.91 26.22,12.9 26.26,12.9 26.62,13.26 v26.62,14.5 32.34,14.5 32.47,14.64 32.47,21.31 28.97,24.81 20.58,24.81 v20.55,24.78
P0.07  (via drill 0.35)
  Top 0.152: U4.6 16.33,22.5 17.53,23.7 18.31,23.7 18.31,23.69 18.8,23.69 18.8,23.7 19.6,23.7 19.6,24.81 18.84,24.81 18.8,24.85 18.78,24.85 17.04,26.59 | 15.65,30.99 arc26 14.73,32.2 arc-45 14.5,32.77 14.5,34.76 v17.06,34.76 | U1.9 27.32,39.8 27.31,39.8 26.53,39.8 v21.59,34.86
  Top 0.17: 15.65,30.99 arc111 16.63,30.81 arc-270 16.63,29.99 arc270 16.63,29.11 arc-270 16.63,28.3 arc121 15.57,28 arc90 16.17,27.4 16.97,27.4
  Top 0.254: 17.04,26.59 arc90 17.41,26.96 | 17.41,26.96 17.41,26.99 | 17.41,26.96 arc90 16.97,27.4
  Bottom 0.152: v17.06,34.76 21.49,34.76 v21.59,34.86
P0.11  (via drill 0.2)
  Top 0.152: v26.41,49.93 26.87,50.39 U6.4
  Top 0.17: v27.97,37.11 v27.98,37.11 29.16,37.11 29.5,37.46 U1.14
  Bottom 0.152: v27.97,37.11 27.97,37.4 28.49,37.92 28.49,38.81 29.73,40.04 29.74,40.04 29.74,45.68 28.36,47.06 28.36,48.92 27.79,49.49 27.78,49.48 26.85,49.48 v26.41,49.93
P0.12  (via drill 0.2)
  Top 0.152: U6.9 28.09,47.32 28.18,47.23 v29.07,47.23
  Top 0.17: v29.05,36.58 29.19,36.58 29.9,37.3 U1.15
  Bottom 0.17: v29.07,47.23 30.23,46.07 30.23,39.91 28.82,38.51 28.82,36.81 v29.05,36.58
P0.13  (via drill 0.2)
  Top 0.152: v30.48,48.29 30.04,48.73 U6.12
  Top 0.17: U1.16 30.3,37.04 29.91,36.65 v29.91,36.57
  Bottom 0.152: 30.88,47.31 30.88,47.89 v30.48,48.29
  Bottom 0.17: 29.93,36.59 v29.91,36.57 29.32,37.16 29.32,38.15 30.88,39.71 30.88,47.31
P0.14  (via drill 0.2)
  Top 0.152: v31,49.21 30.98,49.23 U6.13
  Top 0.17: U1.17 30.7,36.66 v30.62,36.58
  Bottom 0.152: v30.62,36.58 30.11,37.09 30.11,38.4 31.33,39.61 31.33,48.88 v31,49.21
P0.15  (via drill 0.2)
  Top 0.152: v31.97,49.08 31.33,49.73 U6.14
  Top 0.17: U1.18 31.1,36.78 v31.31,36.58
  Bottom 0.152: 32.01,47 32.01,49.04 v31.97,49.08
  Bottom 0.17: 32.01,47 32.01,37.28 v31.31,36.58
P0.16  (via drill 0.2)
  Top 0.152: v32.89,49.7 32.2,50.39 U6.1
  Top 0.17: U1.19 31.5,37.1 32.02,36.58 v32.03,36.58
  Bottom 0.17: v32.89,49.7 32.89,41.94 32.6,41.64 32.6,37.14 v32.03,36.58
RF
  Top 0.15: AE1.1 36.09,33.53 L1.2
SWDCLK  (via drill 0.2)
  Top 0.152: v33.29,36.59 34.3,37.61 U1.25
  Bottom 0.2: v33.29,36.59 32.73,36.04 28.29,36.04 28.2,35.95 28.2,32.9 SWDCLK.TP
SWDIO  (via drill 0.2)
  Top 0.152: U1.26 34.7,39 34.92,38.78 34.92,37.48 33.65,36.21 v33.65,36.06
  Bottom 0.152: v33.65,36.06 33.37,35.78 31.39,35.78 30.4,34.8 30.4,33.4 29.7,32.7 29.3,32.7 SWDIO.TP
V_RECT
  Top 0.152: U$32.P$4 16.57,50.53 16.44,50.4 U$43.2 15.55,49.81 U$17.P$3
  Top 0.2: U$17.P$3 14.91,49.93 arc45 14.35,49.7 arc45 14.09,49.08 14.09,48.74 arc45 14.33,48.17 14.4,48.09 arc45 14.55,48.03 U$17.P$1
V_REG
  Top 0.152: 11.56,48.05 U$45.2 11.63,48.02 U$17.P$5 12.48,48.03 12.38,47.93 12.38,47.11 U$46.2
VBAT  (via drill 0.2)  (1 unrouted)
  Top 0.152: U2.8 12.71,41.83 C28.1 12.74,41.6 11.77,40.64 v11.77,40.61
  Top 0.406: v11.79,38.7 TP5.TP v11.77,36.9 12.34,37.47
  Bottom 0.152: v11.77,40.61
  Bottom 0.406: 11.78,39.45 v11.77,40.61 | 11.78,39.45 10.03,38.76 | 10.03,38.76 9.45,38.17 9.45,37.37 | 10.03,38.76 10.03,37.39 9.46,37.39 9.45,37.37 | 9.45,36.99 9.45,37.37 | v11.76,36.91 v11.77,36.9 11.2,36.34 11.18,36.34 11.18,36.9 9.94,36.9 arc45 9.93,36.9 | v11.79,38.7 11.78,39.45
VBAT1
  Top 0.152: C9.1 18.47,45.72 18.46,45.73 U5.3
VDD_P3V3  (via drill 0.2, 0.35)  (3 unrouted)
  Top 0.152: C5.1 29.1,37.64 U1.13 | v27.43,38.32 27.41,38.3 C5.1 | 27.52,48.14 U6.8 | C31.2 C32.2 | U5.2 18.83,43.41 | U5.2 v23.17,39.27 v23.17,39.26 | C5.1 27.27,37.49 27.27,37.37 26.78,36.89 v26.33,36.89 | U5.2 18.83,42.64 18.72,42.52 18.72,42.4 C22.1 | D2.A 27.84,14.75 v27.36,15.23 | v21.22,22.87 19.7,22.87 R14.2 19.45,22.65 C25.1 17.75,22.47 16.36,21.08 16.36,19.12 16.2,18.97 15.28,18.97 15.13,19.12 15.13,19.49 U4.3 14.99,18.56 v15.24,18.31 | R10.2 24.74,12.11 v24.75,12.12 | 9.7,30.99 arc26 8.78,32.2 arc-45 8.55,32.77 16.41,40.63 v20.42,40.63 | v22.05,43.15 19.29,43.15 U5.2 | v13.23,18.31 11.03,20.52 11.03,27.39
  Top 0.17: 9.7,30.99 arc111 10.69,30.8 arc-270 10.69,29.99 arc270 10.69,29.11 arc-270 10.69,28.29 arc121 9.62,27.99 arc90 10.22,27.39 11.03,27.39
  Top 0.2: 26.96,46.29 29.19,46.29
  Top 0.203: C8.1 31.9,46.5 32.25,46.15 32.25,45.3 33.1,44.45 33.75,44.45 34.3,43.9 U1.36 | U6.5 26.97,49.73 26.39,49.15 C31.2 | C32.2 27.52,48.14 | 26.96,46.29 27.59,46.92 U6.8
  Top 0.254: U1.48 29.1,43.85 28.9,44.05 28.9,46 C10.1 29.19,46.29 | 29.3,46.4 29.85,46.95 31.35,46.95 arc-90 31.6,46.7 C8.1
  Bottom 0.152: 29.1,45.51 29.02,45.51 | v23.17,39.26 25.54,36.89 v26.33,36.89 | v27.36,15.23 25.13,17.46 | 25.13,17.46 21.22,21.37 v21.22,22.87 | v24.75,12.12 24.75,17.08 25.13,17.46 | v20.42,40.63 20.42,41.51 v22.05,43.15 | v15.24,18.31 v13.23,18.31
  Bottom 0.203: 29.1,45.51 29.1,43.85 28.65,43.4 27.9,43.4 27.68,43.18 27.68,38.57 v27.43,38.32 | 29.02,45.51 v28.24,46.29
X1
  Top 0.152: U1.34 34.85,42.2 36.6,43.95 36.6,45.95 36.3,46.25 C1.1 35.5,46.25 X1.1